# EAGLE design Core Shield Shield (EAGLE 6.4)
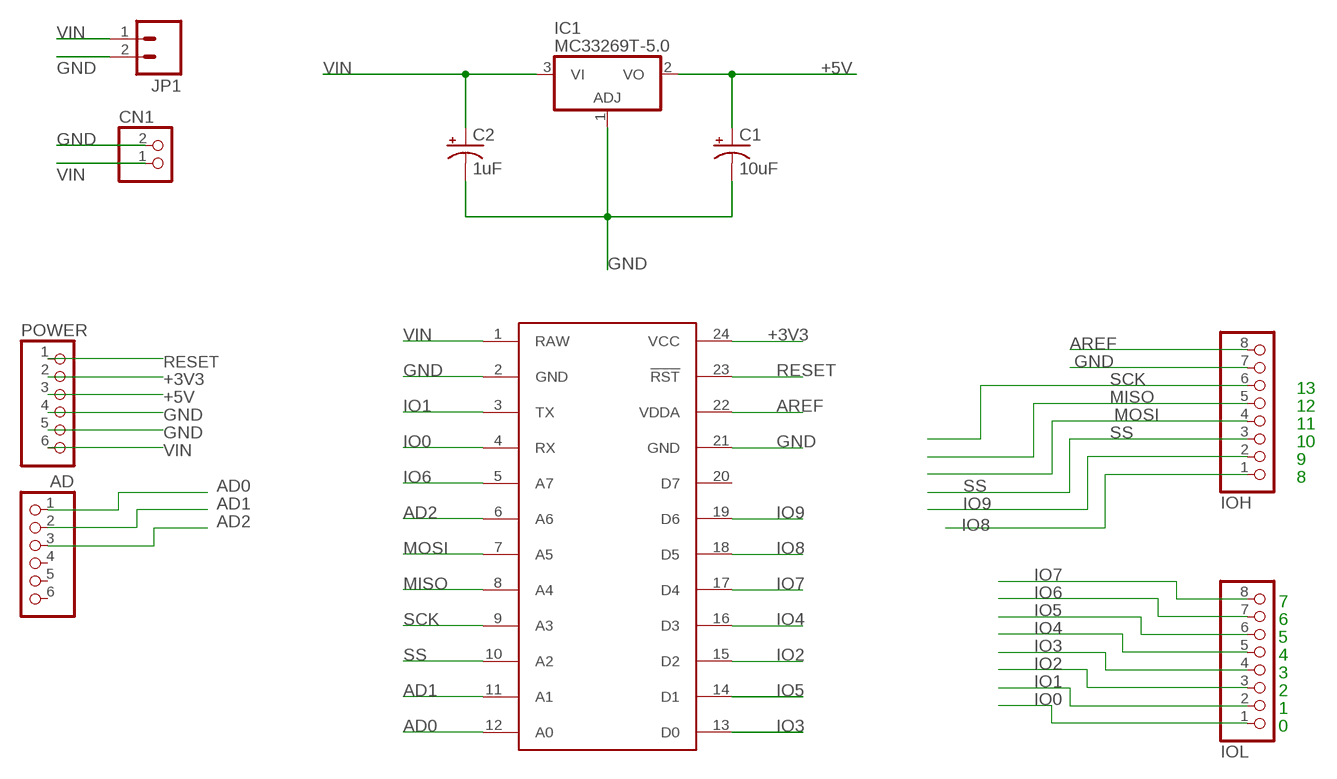
[diagram p0: schematic, sheet 1]

## Parts
AD  PINHD-1X6  [1X06]
C1  10uF  CAP_POLPTH2  [CPOL-RADIAL-10UF-25V]
C2  1uF  CAP_POLPTH2  [CPOL-RADIAL-10UF-25V]
CN1  JST_2PIN-THM  [JST-PH-2-THM]
IC1  MC33269T-5.0  [TO220V]
IOH  PINHD-1X8  [1X08]
IOL  PINHD-1X8  [1X08]
JP1  M02LOCK  [1X02_LOCK]
POWER  PINHD-1X6  [1X06]
U$1  SPARK_CORECORE  [SPARK_CORE]

## Nets
+3V3: POWER.2 U$1.24(VCC)
+5V: C1.1(+) IC1.2(VO) POWER.3
AD0: AD.1 U$1.12(A0)
AD1: AD.2 U$1.11(A1)
AD2: AD.3 U$1.6(A6)
AREF: IOH.8 U$1.22(VDDA)
GND: C1.2(-) C2.2(-) CN1.2 IC1.1(ADJ) IOH.7 JP1.2 POWER.4 POWER.5 U$1.2(GND) U$1.21(GND)
IO0: IOL.1 U$1.4(RX)
IO1: IOL.2 U$1.3(TX)
IO2: IOL.3 U$1.15(D2)
IO3: IOL.4 U$1.13(D0)
IO4: IOL.5 U$1.16(D3)
IO5: IOL.6 U$1.14(D1)
IO6: IOL.7 U$1.5(A7)
IO7: IOL.8 U$1.17(D4)
IO8: IOH.1 U$1.18(D5)
IO9: IOH.2 U$1.19(D6)
MISO: IOH.5 U$1.8(A4)
MOSI: IOH.4 U$1.7(A5)
RESET: POWER.1 U$1.23(!RST)
SCK: IOH.6 U$1.9(A3)
SS: IOH.3 U$1.10(A2)
VIN: C2.1(+) CN1.1 IC1.3(VI) JP1.1 POWER.6 U$1.1(RAW)
Unconnected: AD.4 AD.5 AD.6 U$1.20(D7)

## Notes on the sheet
- 13
- 12
- 11
- 10
- 9
- 8
- 7
- 6
- 5
- 4
- 3
- 2
- 1
- 0

## Library data of the parts
AD POWER = pinhead:PINHD-1X6: PIN HEADER
C1 C2 = SparkFun-Capacitors:CAP_POL: Capacitor Polarized These are standard SMD and PTH capacitors. Normally 10uF, 47uF, and 100uF in electrolytic and tantalum varieties. Always verify the external diameter of the through hole cap, it varies with capacity, voltage, and manufacturer. The EIA devices should be standard.
CN1 = adafruit:JST_2PIN: JST 2-Pin Connectors of various flavors SMT-RA (S2B-PH-SM4) 4UConnector #17311 SMT (B2B-PH-SM4) THM-RA (S2B-PH) THM (B2B-PH)
IC1 = linear:MC33269?*: Adjustable Output Low Dropout Voltage Regulator 800 mA Source: http://www.onsemi.com/pub/Collateral/MC33269-D.PDF
IOH IOL = pinhead:PINHD-1X8: PIN HEADER
JP1 = SparkFun-Connectors:M02: Header 2 Standard 2-pin 0.1" header. Use with straight break away headers (SKU : PRT-00116), right angle break away headers (PRT-00553), swiss pins (PRT-00743), machine pins (PRT-00117), and female headers (PRT-00115). Molex polarized connector foot print use with SKU : PRT-08233 with associated crimp pins and housings.
U$1 = Spark:SPARK_CORE

## Net classes
0 default: width 0.152 mm, drill 0.305 mm, clearance 0.152 mm

## Board
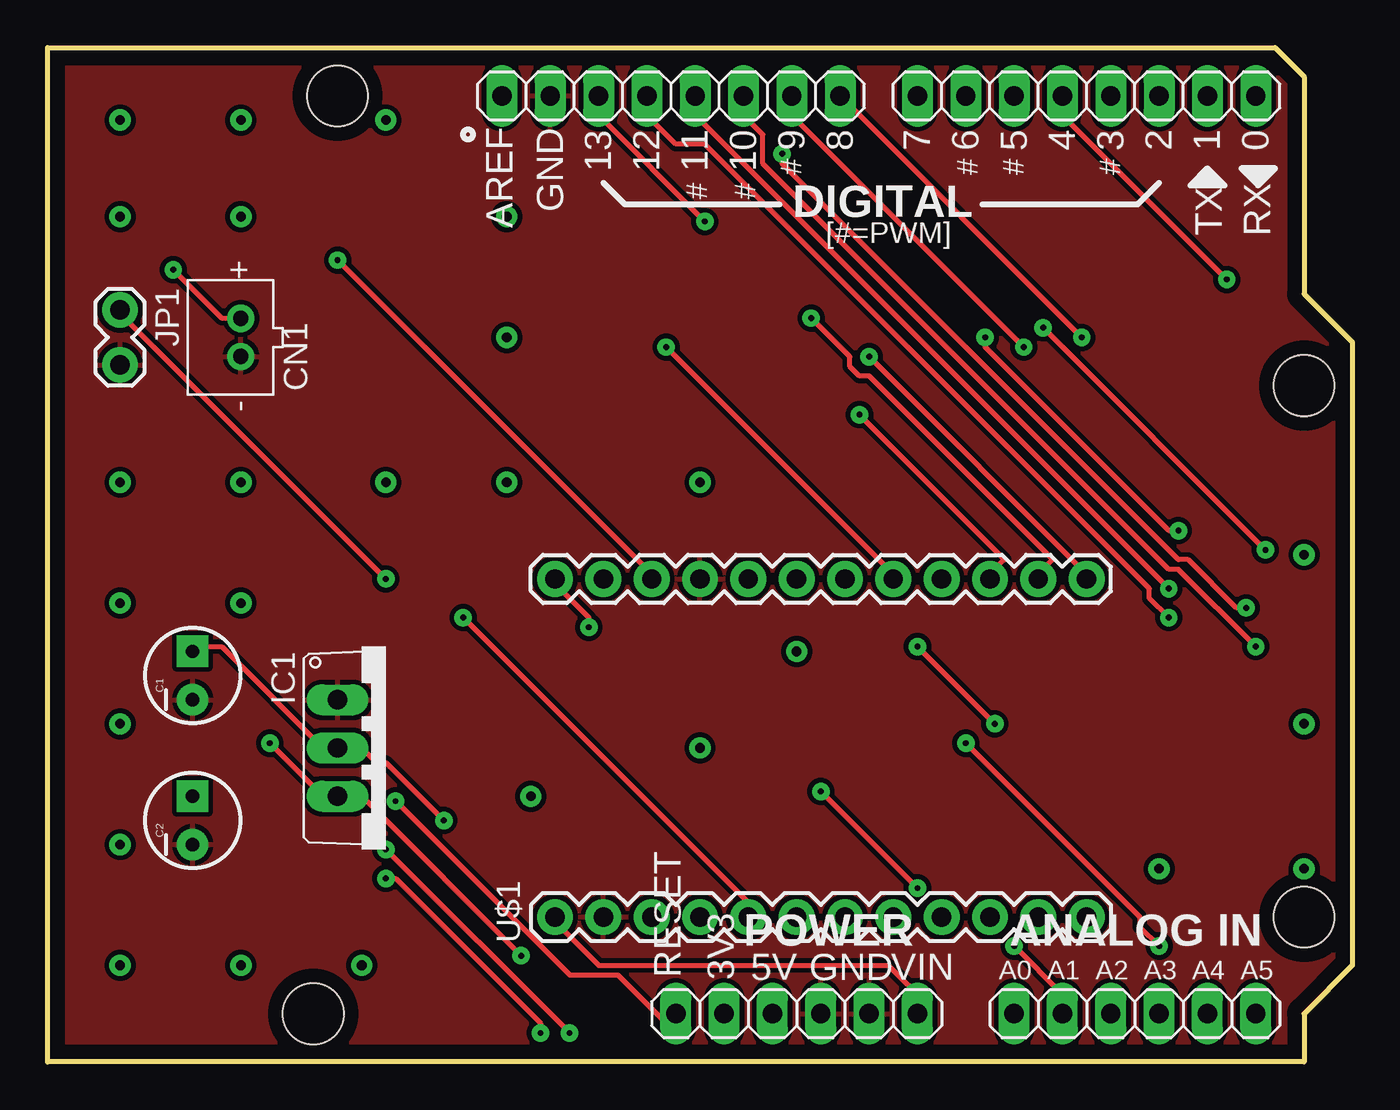
[diagram p1: board, top side]
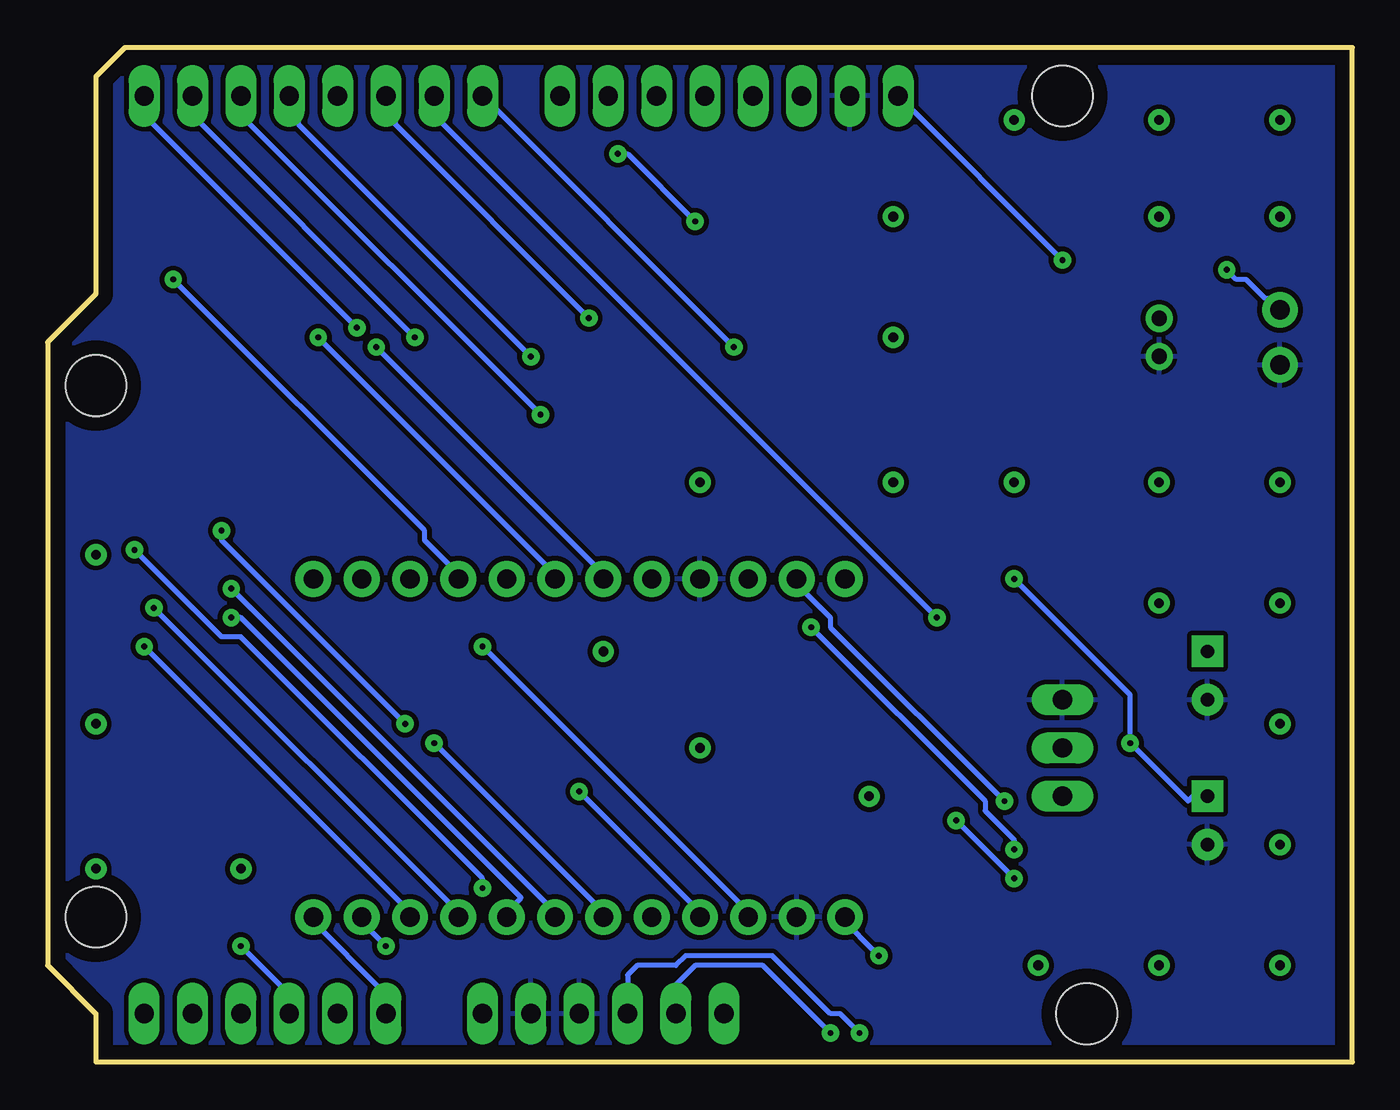
[diagram p2: board, bottom side, seen from below]

Size 68.58 x 53.34 mm. Coordinates in mm from the lower left corner, seen from the top.
Outline: 0,53.34 64.52,53.34 66.04,51.82 66.04,40.39 68.58,37.85 68.58,5.08 66.04,2.54 66.04,0 0,0 0,53.34
Copper layers (1*16): Top 0.035mm / dielectric 1.5mm / Bottom 0.035mm
Design rules "default *": minimum track width 10mil, minimum drill 12mil, track to track 10mil, track to pad 10mil, pad to pad 10mil, via to via 10mil, smd to smd 10mil, copper to edge 30mil, drill to drill 12mil, minimum pad ring 12mil, minimum via ring 12mil, stop-mask expansion 1mil, vias tented up to drill 0mil, thermal gap 10mil
Holes 3.2 mm at 66.04,35.56 66.04,7.62 15.24,50.8 13.97,2.54
vRestrict: area 47.9,10.3 to 48.5,10.8; area 50.4,10.2 to 50.9,11

### Footprints (pad centres in the part's own frame; a part is rotated, then mirrored left to right if it is on the bottom)
1X06 = drill 1.016 long: 1 -6.35,0; 2 -3.81,0; 3 -1.27,0; 4 1.27,0; 5 3.81,0; 6 6.35,0
CPOL-RADIAL-10UF-25V = drill 0.7 pad 1.651 square: 1 1.27,0 | drill 0.7 pad 1.651: 2 -1.27,0
JST-PH-2-THM = drill 0.8 pad 1.422: 1 1,0; 2 -1,0
TO220V = drill 1.016 long: 1 -2.54,-2.54; 2 0,-2.54; 3 2.54,-2.54
1X08 = drill 1.016 long: 1 -8.89,0; 2 -6.35,0; 3 -3.81,0; 4 -1.27,0; 5 1.27,0; 6 3.81,0; 7 6.35,0; 8 8.89,0
1X02_LOCK = drill 1.016 pad 1.88: 1 -0.178,0; 2 2.718,0
SPARK_CORE = drill 1.016 pad 1.88: 1 -8.89,13.97; 2 -8.89,11.43; 3 -8.89,8.89; 4 -8.89,6.35; 5 -8.89,3.81; 6 -8.89,1.27; 7 -8.89,-1.27; 8 -8.89,-3.81; 9 -8.89,-6.35; 10 -8.89,-8.89; 11 -8.89,-11.43; 12 -8.89,-13.97; 13 8.89,-13.97; 14 8.89,-11.43; 15 8.89,-8.89; 16 8.89,-6.35; 17 8.89,-3.81; 18 8.89,-1.27; 19 8.89,1.27; 20 8.89,3.81; 21 8.89,6.35; 22 8.89,8.89; 23 8.89,11.43; 24 8.89,13.97

### Placement (x,y rotation side)
AD  57.15,2.54 0 top
C1  7.62,20.32 90 top
C2  7.62,12.7 90 top
CN1  10.16,38.1 90 top
IC1  17.78,16.51 270 top
IOH  32.77,50.8 180 top
IOL  54.61,50.8 180 top
JP1  3.81,39.37 270 top
POWER  39.37,2.54 0 top
U$1  40.64,16.51 90 top

### Tracks (layer width: path | path; a pad name or v marks a point on that pad's centre or on a via)
+3V3  (via drill 0.3)
  Top 0.254: v17.78,11.18 v27.43,1.52 | v28.45,22.86 28.45,23.37 26.42,25.4 U$1.24
  Bottom 0.254: POWER.2 35.56,4.06 34.54,5.08 30.99,5.08 v27.43,1.52 | v17.78,11.18 17.78,11.68 19.3,13.21 19.3,13.72 v28.45,22.86
+5V  (via drill 0.3)
  Top 0.254: C1.1 7.62,21.84 9.14,21.84 14.73,16.26 15.24,16.26 IC1.2 15.24,16.76 15.75,16.76 16.26,16.26 16.76,16.26 17.27,15.75 17.78,15.75 v20.83,12.7 | v25.91,1.52 25.91,2.03 18.29,9.65 v17.78,9.65
  Bottom 0.254: POWER.3 38.1,4.57 37.59,5.08 35.56,5.08 35.05,5.59 30.48,5.59 27.43,2.54 26.92,2.54 v25.91,1.52 | v20.83,12.7 v17.78,9.65
AD0
  Bottom 0.254: AD.1 50.8,3.56 54.86,7.62 U$1.12
AD1  (via drill 0.3)
  Top 0.254: AD.2 53.34,3.56 v50.8,6.1
  Bottom 0.254: v50.8,6.1 52.32,7.62 U$1.11
AD2  (via drill 0.3)
  Top 0.254: v58.42,6.1 57.4,7.11 57.4,7.62 v48.26,16.76
  Bottom 0.254: AD.3 55.88,3.56 v58.42,6.1 | v48.26,16.76 39.12,7.62 U$1.6
AREF  (via drill 0.3)
  Top 0.254: v15.24,42.16 32,25.4 U$1.22
  Bottom 0.254: v15.24,42.16 IOH.8
GND
  pour Bottom (rank 2): 0.64,52.7 67.69,52.7 67.94,52.45 67.94,0.64 0.89,0.64 0.64,0.89 0.64,30.48 0.64,46.35
  pour Top (rank 2): 0.64,52.7 67.94,52.7 67.94,0.64 0.64,0.64 0.64,30.48 0.64,46.35
IO0  (via drill 0.3)
  Top 0.254: v64.01,26.92 v52.32,38.61 | v40.64,14.22 v45.72,9.14
  Bottom 0.254: IOL.1 63.5,49.78 v52.32,38.61 | v64.01,26.92 59.44,22.35 58.42,22.35 45.72,9.65 v45.72,9.14 | v40.64,14.22 34.04,7.62 U$1.4
IO1  (via drill 0.3)
  Top 0.254: v49.28,38.1 49.28,37.59 58.93,27.94 v59.44,27.94 | v45.72,21.84 v49.78,17.78
  Bottom 0.254: IOL.2 60.96,49.78 v49.28,38.1 | v59.44,27.94 59.44,27.43 v49.78,17.78 | v45.72,21.84 31.5,7.62 U$1.3
IO2  (via drill 0.3)
  Top 0.254: v42.67,34.04 50.29,26.42 49.78,25.91 49.78,25.4 U$1.15
  Bottom 0.254: IOL.3 58.42,49.78 v42.67,34.04
IO3  (via drill 0.3)
  Top 0.254: v43.18,37.08 54.86,25.4 U$1.13
  Bottom 0.254: IOL.4 55.37,50.29 55.37,49.28 v43.18,37.08
IO4  (via drill 0.3)
  Top 0.254: IOL.5 53.34,49.78 v61.98,41.15
  Bottom 0.254: v61.98,41.15 48.77,27.94 48.77,27.43 46.74,25.4 U$1.16
IO5  (via drill 0.3)
  Top 0.254: v40.13,39.12 42.16,37.08 42.16,36.58 42.67,36.07 43.18,36.07 52.83,26.42 52.32,25.91 52.32,25.4 U$1.14
  Bottom 0.254: IOL.6 50.29,50.29 50.29,49.28 v40.13,39.12
IO6  (via drill 0.3)
  Top 0.254: v21.84,23.37 37.08,8.13 37.08,7.62 U$1.5
  Bottom 0.254: IOL.7 48.26,49.78 v21.84,23.37
IO7  (via drill 0.3)
  Top 0.254: v32.51,37.59 44.7,25.4 U$1.17
  Bottom 0.254: v32.51,37.59 IOL.8
IO8  (via drill 0.3)
  Top 0.254: v54.36,38.1 IOH.1
  Bottom 0.254: v54.36,38.1 41.66,25.4 U$1.18
IO9  (via drill 0.3)
  Top 0.254: IOH.2 39.12,49.78 v51.31,37.59
  Bottom 0.254: v51.31,37.59 39.12,25.4 U$1.19
MISO  (via drill 0.3)
  Top 0.254: IOH.5 31.5,49.78 33.02,48.26 34.54,48.26 57.91,24.89 57.91,24.38 v58.93,23.37
  Bottom 0.254: v58.93,23.37 58.42,23.37 43.69,8.64 44.2,8.13 44.2,7.62 U$1.8
MOSI  (via drill 0.3)
  Top 0.254: IOH.4 34.04,49.78 v58.93,24.89
  Bottom 0.254: v58.93,24.89 41.66,7.62 U$1.7
N$1  (via drill 0.51)
  other vias: 3.81,49.53
N$2  (via drill 0.51)
  other vias: 10.16,49.53
N$3  (via drill 0.51)
  other vias: 10.16,44.45
N$4  (via drill 0.51)
  other vias: 3.81,44.45
N$5  (via drill 0.51)
  other vias: 3.81,30.48
N$6  (via drill 0.51)
  other vias: 10.16,30.48
N$7  (via drill 0.51)
  other vias: 10.16,24.13
N$8  (via drill 0.51)
  other vias: 3.81,24.13
N$9  (via drill 0.51)
  other vias: 3.81,17.78
N$10  (via drill 0.51)
  other vias: 3.81,11.43
N$11  (via drill 0.51)
  other vias: 3.81,5.08
N$12  (via drill 0.51)
  other vias: 10.16,5.08
N$13  (via drill 0.51)
  other vias: 16.51,5.08
N$14  (via drill 0.51)
  other vias: 17.78,30.48
N$15  (via drill 0.51)
  other vias: 24.13,30.48
N$16  (via drill 0.51)
  other vias: 24.13,38.1
N$17  (via drill 0.51)
  other vias: 17.78,49.53
N$18  (via drill 0.51)
  other vias: 24.13,44.45
N$19  (via drill 0.51)
  other vias: 25.4,13.97
N$20  (via drill 0.51)
  other vias: 34.29,16.51
N$21  (via drill 0.51)
  other vias: 34.29,30.48
N$22  (via drill 0.51)
  other vias: 58.42,10.16
N$23  (via drill 0.51)
  other vias: 66.04,10.16
N$24  (via drill 0.51)
  other vias: 66.04,17.78
N$25  (via drill 0.51)
  other vias: 66.04,26.67
N$26  (via drill 0.51)
  other vias: 39.37,21.59
RESET  (via drill 0.3)
  Top 0.254: POWER.1 32.51,2.03 29.97,4.57 27.43,4.57 v18.29,13.72
  Bottom 0.254: v18.29,13.72 27.43,22.86 27.43,23.37 29.46,25.4 U$1.23
SCK  (via drill 0.3)
  Top 0.254: IOH.6 28.96,49.78 v34.54,44.2 | v38.61,47.75 38.61,47.24 59.44,26.42 59.94,26.42 62.48,23.88 v62.99,23.88
  Bottom 0.254: v34.54,44.2 38.1,47.75 v38.61,47.75 | v62.99,23.88 46.74,7.62 U$1.9
SS  (via drill 0.3)
  Top 0.254: IOH.3 36.58,49.78 37.59,48.77 37.59,47.24 58.93,25.91 59.44,25.91 v63.5,21.84
  Bottom 0.254: v63.5,21.84 49.28,7.62 U$1.10
VIN  (via drill 0.3)
  Top 0.254: POWER.6 46.23,3.05 44.2,5.08 28.96,5.08 26.42,7.62 U$1.1 | v6.6,41.66 9.14,39.12 9.65,39.12 10.16,38.61 CN1.1 | v11.68,16.76 14.73,13.72 15.24,13.72 IC1.3 15.24,14.22 15.75,14.22 16.26,13.72 16.76,13.72 v24.89,5.59 | v17.78,25.4 4.06,39.12 JP1.1
  Bottom 0.254: v6.6,41.66 6.1,41.15 5.59,41.15 4.57,40.13 4.06,40.13 3.56,39.62 JP1.1 | C2.1 7.62,13.72 8.13,14.22 8.64,13.72 v11.68,16.76 11.68,19.3 v17.78,25.4 | v24.89,5.59 26.92,7.62 U$1.1

### Text on the board
tPlace: 13 | 12 | 11 | 10 | 9 | 8 | 7 | 6 | 5 | 4 | 3 | 2 | 1 | 0
tNames: AREF | GND | # | # | # | # | # | # | DIGITAL | [#=PWM] | TX | RX | ANALOG IN | RESET | 3V3 | 5V | GND | VIN | A0 | A1 | A2 | A3 | A4 | A5
214bmp: D:/SmartProjects/Snc/a4_bn_logo2.bmp